# EAGLE board new_sawtag_2012 (EAGLE 6.5.0), part 1 of 2
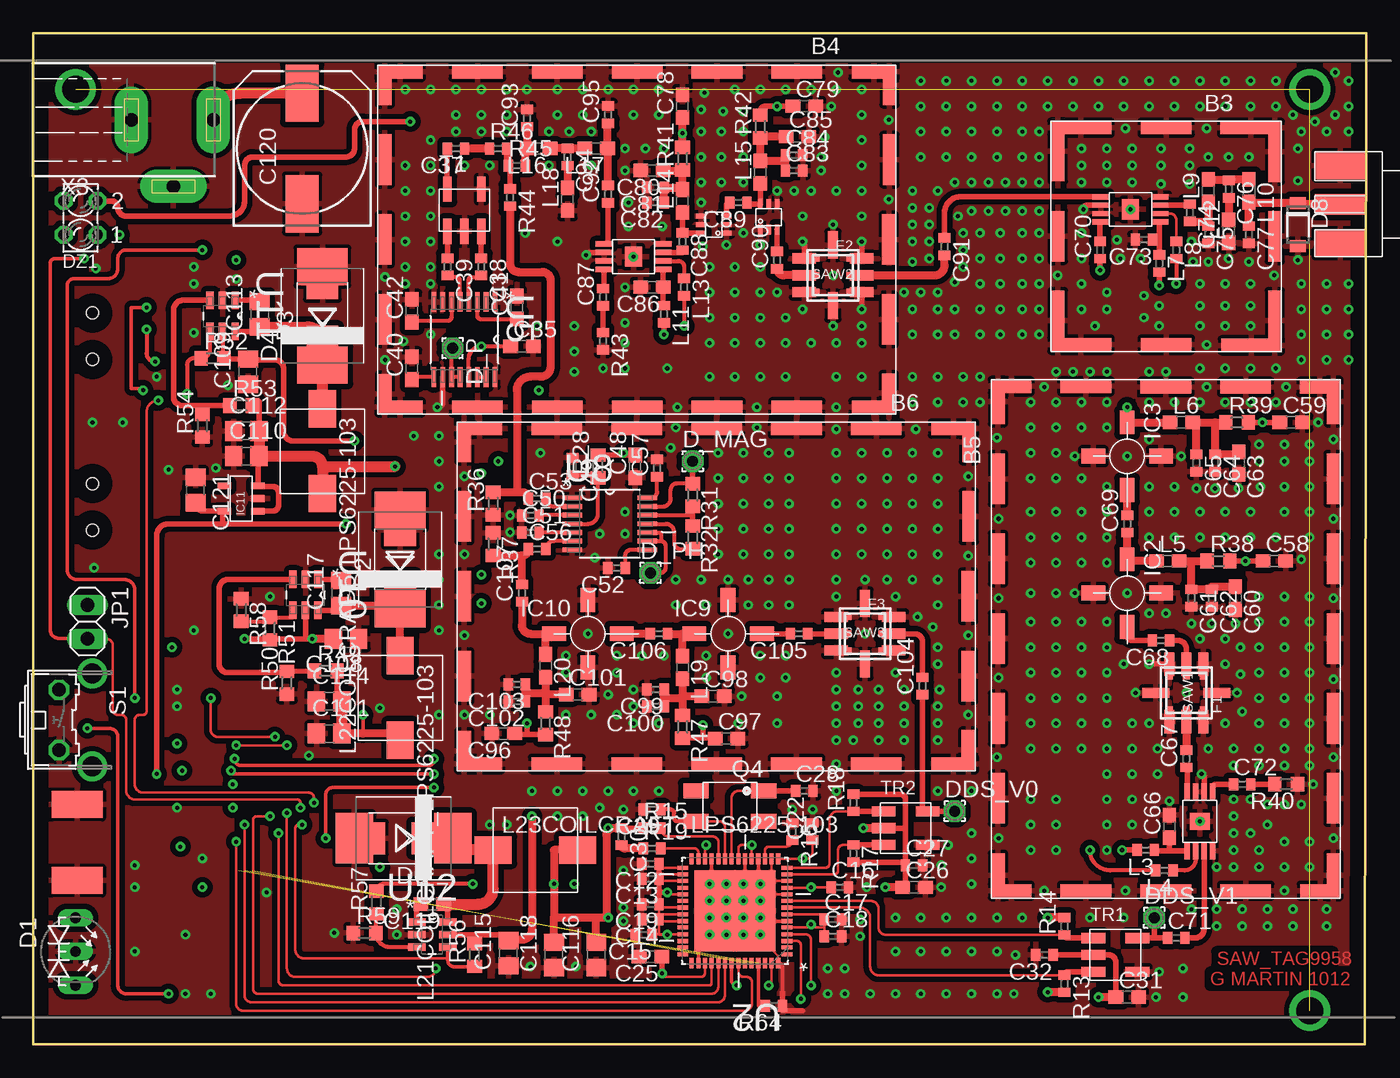
[diagram p4: board, top side]
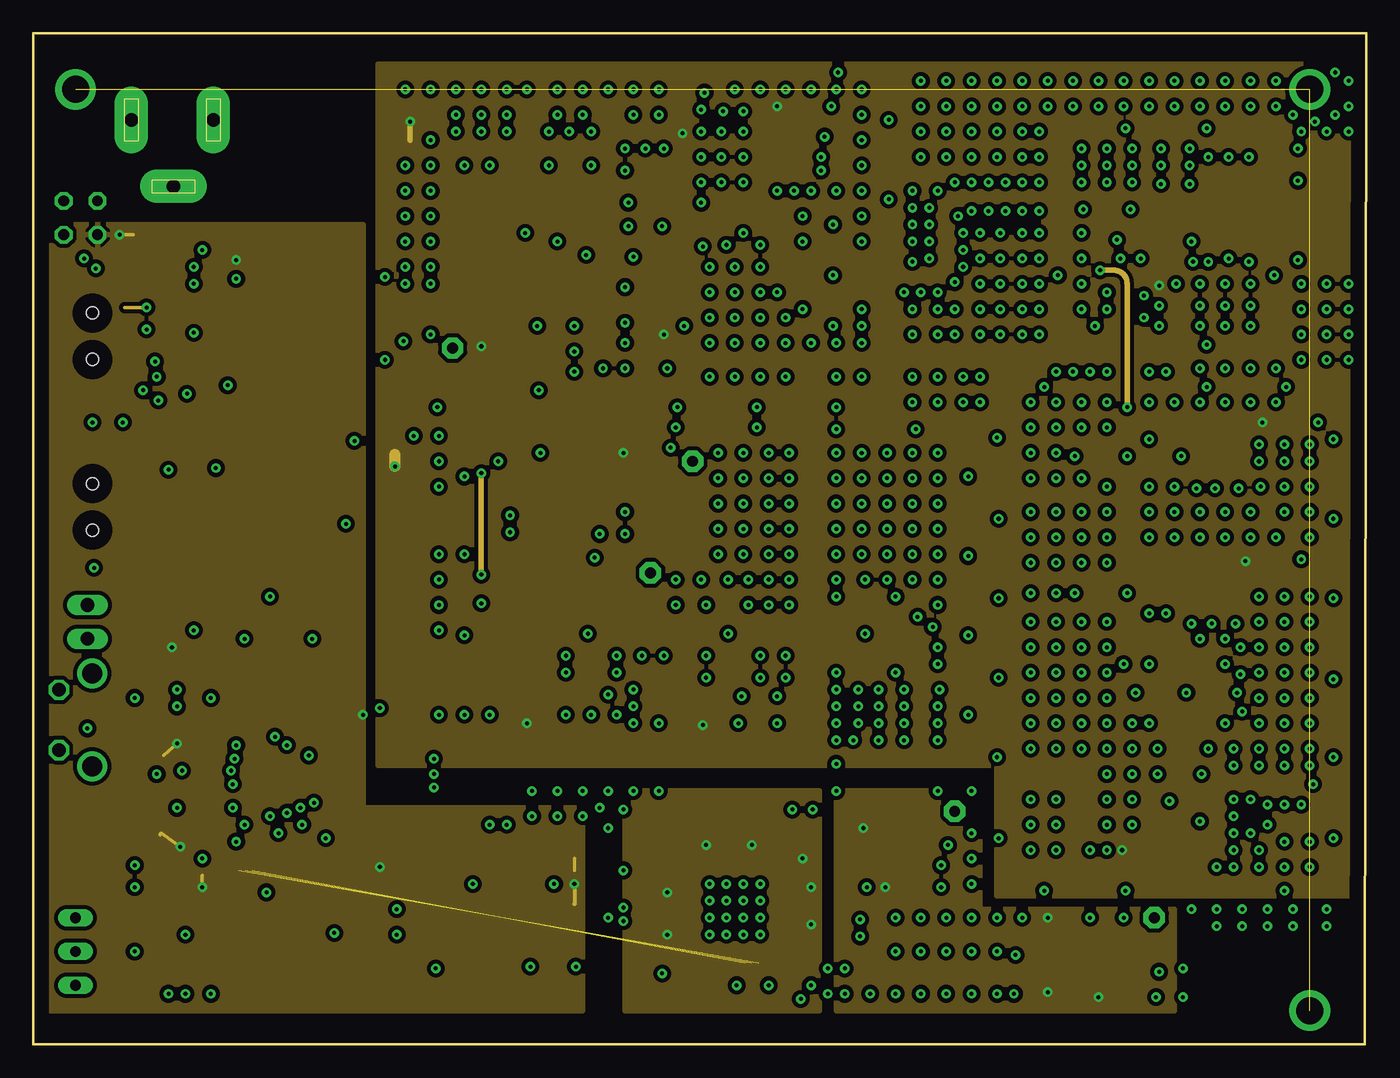
[diagram p5: board, inner layer Route2]
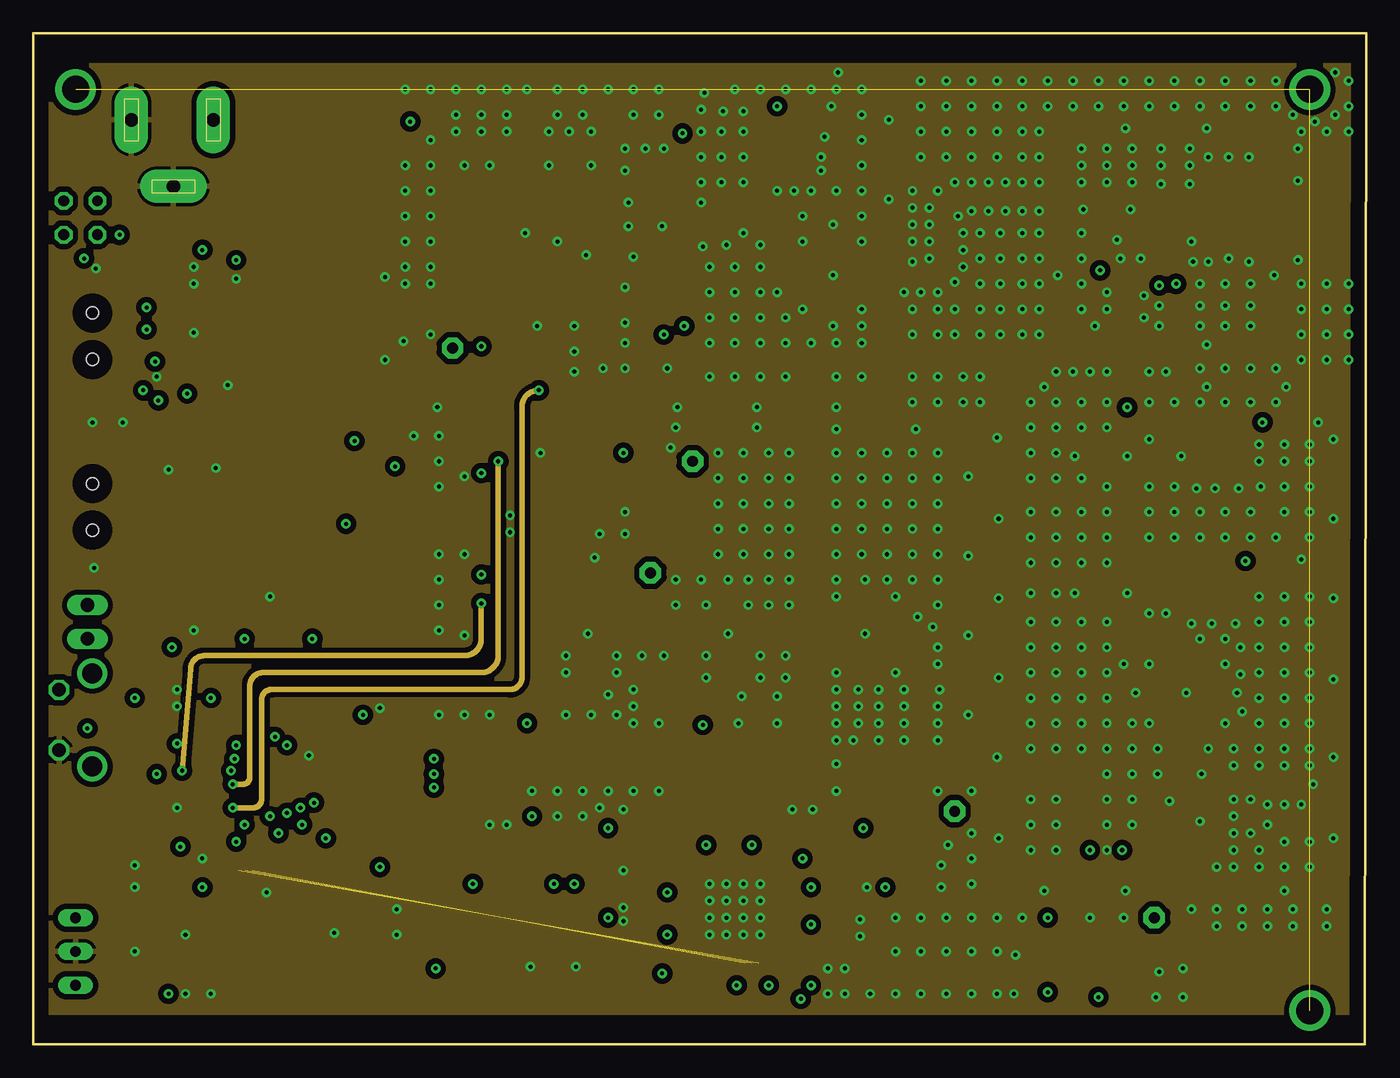
[diagram p6: board, inner layer Route3]
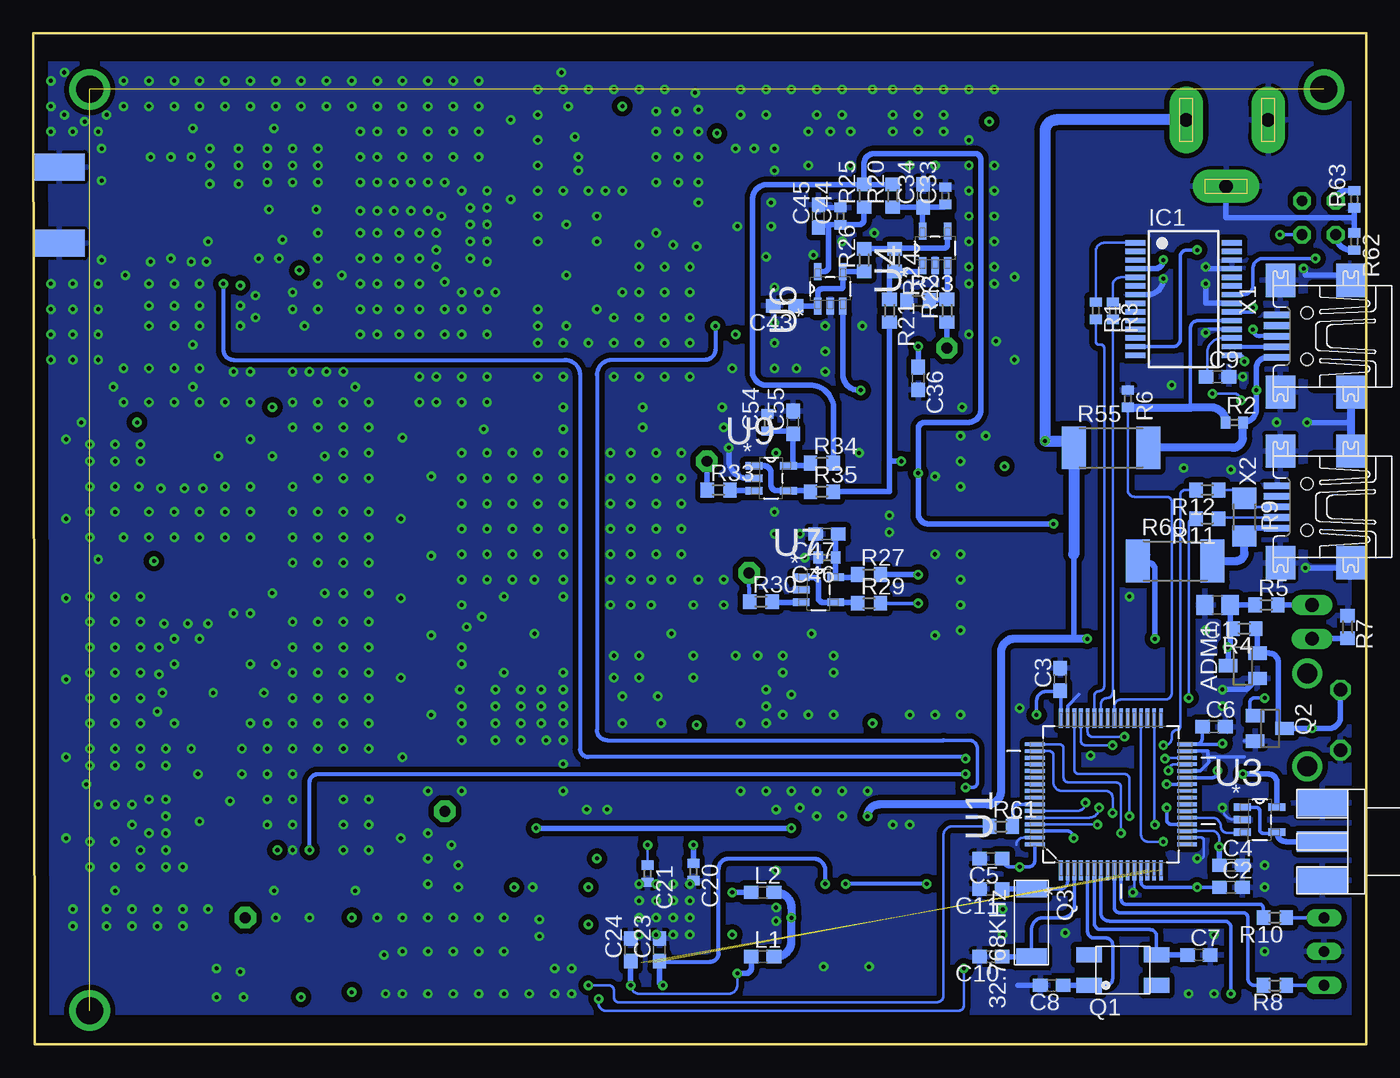
[diagram p7: board, bottom side, seen from below]

Size 100.13 x 75.97 mm. Coordinates in mm from the lower left corner, seen from the top.
Outline: 0,0 100,0 100.13,75.97 0,75.97 0,0
Copper layers (1*2+3*16): Top 0.035mm / dielectric 1.5mm / Route2 0.035mm / dielectric 0.15mm / Route3 0.035mm / dielectric 0.2mm / Bottom 0.035mm
Design rules "default": minimum track width 10mil, minimum drill 24mil, track to track 5mil, track to pad 5mil, pad to pad 5mil, via to via 5mil, smd to smd 5mil, copper to edge 40mil, drill to drill 8mil, minimum pad ring 10mil, minimum via ring 8mil, stop-mask expansion 4mil, vias tented up to drill 0mil, thermal gap 10mil

## Footprints (pad centres in the part's own frame; a part is rotated, then mirrored left to right if it is on the bottom)
SOT23 = smd 1 x 1.4: 1 -0.95,-1.1; 2 0.95,-1.1; 3 0,1.1
BMIS-102 = smd 4.55 x 1: P$1 2.25,0.5; P$3 15.05,0.45; P$10 2.25,16.8; P$11 15,16.8 | smd 3.8 x 1: P$2 8.65,0.5; P$12 8.65,16.8 | smd 1 x 4.55: P$4 0.5,2.3; P$6 0.5,15.05; P$7 16.8,2.3; P$9 16.8,15 | smd 1 x 3.8: P$5 0.5,8.65; P$8 16.8,8.65
BMIS-205 = smd 3.35 x 1: P$1 1.65,0.5; P$7 37.25,0.5; P$13 1.65,25.7; P$19 37.25,25.7 | smd 3.8 x 1: P$2 7.45,0.5; P$3 13.45,0.5; P$4 19.45,0.5; P$5 25.45,0.5; P$6 31.45,0.5; P$14 7.45,25.7; P$15 13.45,25.7; P$16 19.45,25.7; P$17 25.45,25.7; P$18 31.45,25.7 | smd 1 x 3: P$8 0.5,1.5; P$12 0.5,24.7; P$20 38.35,1.55; P$24 38.4,24.7 | smd 1 x 3.8: P$9 0.5,7.1; P$10 0.5,13.1; P$11 0.5,19.1; P$21 38.35,7.1; P$22 38.35,13.1; P$23 38.4,19.1
C0805 = smd 1.3 x 1.5: 1 -0.95,0; 2 0.95,0
C0603 = smd 1.1 x 1: 1 -0.85,0; 2 0.85,0
C0402 = smd 0.7 x 0.9: 1 -0.65,0; 2 0.65,0
140CLH-1010 = smd 4.3 x 2.5: + 4.15,0; - -4.15,0
DUOLED = drill 0.813 long: A1 -3.81,0; A2 1.27,0; K -1.27,0
SMB = smd 2.4 x 2.4: A 2.2,0; C -2.2,0
SMC = smd 2.8 x 3.8: A 3.7,0; C -3.7,0
SOD123FL = smd 0.91 x 1.22: A 1.625,0; C -1.625,0
1,6/0,8 = drill 0.813 pad 1.6 octagon: 1 0,0
LZR182 = drill 0.813 octagon: A1 -1.27,1.27; A2 -1.27,-1.27; K1 1.27,1.27; K2 1.27,-1.27
BOITIER_3-3 = smd 1.524 x 0.508: P$1 -1.778,1.27; P$2 -1.778,0; P$3 -1.778,-1.27; P$4 1.778,-1.27; P$5 1.778,0; P$6 1.778,1.27
SSOP28 = smd 0.4 x 1.5: 1 -4.225,-3.625; 2 -3.575,-3.625; 3 -2.925,-3.625; 4 -2.275,-3.625; 5 -1.625,-3.625; 6 -0.975,-3.625; 7 -0.325,-3.625; 8 0.325,-3.625; 9 0.975,-3.625; 10 1.625,-3.625; 11 2.275,-3.625; 12 2.925,-3.625; 13 3.575,-3.625; 14 4.225,-3.625; 15 4.225,3.625; 16 3.575,3.625; 17 2.925,3.625; 18 2.275,3.625; 19 1.625,3.625; 20 0.975,3.625; 21 0.325,3.625; 22 -0.325,3.625; 23 -0.975,3.625; 24 -1.625,3.625; 25 -2.275,3.625; 26 -2.925,3.625; 27 -3.575,3.625; 28 -4.225,3.625
VV105 = smd 1.778 x 1.118: 1 -2.54,0; 3 2.54,0 | smd 1.118 x 1.778: 2 0,-2.54; 4 0,2.54
SMT-MS8G = smd 0.406 x 1.27: P$1 -0.953,-2.223; P$2 -0.318,-2.223; P$3 0.318,-2.223; P$4 0.953,-2.223; P$5 0.953,2.223; P$6 0.318,2.223; P$7 -0.318,2.223; P$8 -0.953,2.223 | smd 1.524 x 1.27: P$9 0,0
SOT363 = smd 0.356 x 0.762: P$1 0,0; P$2 0.635,0; P$3 1.27,0; P$4 1.27,1.905; P$5 0.635,1.905; P$6 0,1.905
SOT23-M5 = smd 0.508 x 1.016: 1 -0.953,-1.27; 2 0,-1.27; 3 0.953,-1.27; 4 0.953,1.27; 5 -0.953,1.27
SMA_BORDMIN = smd 3.81 x 2.032: P1 3.175,-2.921; P3 3.175,2.921 | smd 3.81 x 1.524: P2 3.175,0 | smd 3.81 x 2.032 bottom: P4 3.175,2.921; P5 3.175,-2.794
1X02 = drill 1.016 long: 1 -1.27,0; 2 1.27,0
0603 = smd 1.1 x 1: 1 -0.85,0; 2 0.85,0
0402 = smd 0.7 x 0.9: 1 -0.015,0; 2 1.285,0
L_DCDC_6*6 = smd 2.794 x 2.032: P$1 0,0; P$2 6.35,0
SMD_5*3 = smd 1.905 x 1.143: P$1 -2.54,-1.143; P$2 2.54,-1.143; P$3 2.54,1.143; P$4 -2.54,1.143
SMD_32K = smd 1.27 x 2.286: P$1 -2.54,0; P$2 2.54,0
R0402 = smd 0.7 x 0.9: 1 -0.65,0; 2 0.65,0
R0603 = smd 1 x 1.1: 1 -0.85,0; 2 0.85,0
R1206 = smd 1.6 x 1.803: 1 -1.422,0; 2 1.422,0
R2512 = smd 1.8 x 3.2: 1 -2.8,0; 2 2.8,0
B3F-31XX = drill 1.016 octagon: 1 -2.261,-1.245; 2 2.261,-1.245 | drill 1.499 pad 2.159: 3 -3.505,1.245; 4 3.505,1.245
BOITIER_5-5 = smd 1.778 x 0.762: P$1 -2.159,1.27; P$2 -2.159,0; P$3 -2.159,-1.27; P$4 2.159,-1.27; P$5 2.159,0; P$6 2.159,1.27 | smd 0.762 x 2.032: P$7 0,2.286; P$8 0,-2.286
SM-22 = smd 0.635 x 1.905: 1 -1.27,-1.905; 2 0,-1.905; 3 1.27,-1.905; 4 1.27,1.27; 5 -1.27,1.27
AT224-3 = smd 1.778 x 0.762: P1 -1.651,1.27; P2 -1.651,0; P3 -1.651,-1.27; P4 1.651,-1.27; P6 1.651,1.27
QFP50P1200X1200X160-64N = smd 1.473 x 0.279: 1 -5.715,3.759; 2 -5.715,3.251; 3 -5.715,2.743; 4 -5.715,2.261; 5 -5.715,1.753; 6 -5.715,1.245; 7 -5.715,0.762; 8 -5.715,0.254; 9 -5.715,-0.254; 10 -5.715,-0.762; 11 -5.715,-1.245; 12 -5.715,-1.753; 13 -5.715,-2.261; 14 -5.715,-2.743; 15 -5.715,-3.251; 16 -5.715,-3.759; 33 5.715,-3.759; 34 5.715,-3.251; 35 5.715,-2.743; 36 5.715,-2.261; 37 5.715,-1.753; 38 5.715,-1.245; 39 5.715,-0.762; 40 5.715,-0.254; 41 5.715,0.254; 42 5.715,0.762; 43 5.715,1.245; 44 5.715,1.753; 45 5.715,2.261; 46 5.715,2.743; 47 5.715,3.251; 48 5.715,3.759 | smd 0.279 x 1.473: 17 -3.759,-5.715; 18 -3.251,-5.715; 19 -2.743,-5.715; 20 -2.261,-5.715; 21 -1.753,-5.715; 22 -1.245,-5.715; 23 -0.762,-5.715; 24 -0.254,-5.715; 25 0.254,-5.715; 26 0.762,-5.715; 27 1.245,-5.715; 28 1.753,-5.715; 29 2.261,-5.715; 30 2.743,-5.715; 31 3.251,-5.715; 32 3.759,-5.715; 49 3.759,5.715; 50 3.251,5.715; 51 2.743,5.715; 52 2.261,5.715; 53 1.753,5.715; 54 1.245,5.715; 55 0.762,5.715; 56 0.254,5.715; 57 -0.254,5.715; 58 -0.762,5.715; 59 -1.245,5.715; 60 -1.753,5.715; 61 -2.261,5.715; 62 -2.743,5.715; 63 -3.251,5.715; 64 -3.759,5.715
QFN50P800X800X100-57N = smd 0.813 x 0.305: 1 -3.912,3.251; 2 -3.912,2.743; 3 -3.912,2.261; 4 -3.912,1.753; 5 -3.912,1.245; 6 -3.912,0.762; 7 -3.912,0.254; 8 -3.912,-0.254; 9 -3.912,-0.762; 10 -3.912,-1.245; 11 -3.912,-1.753; 12 -3.912,-2.261; 13 -3.912,-2.743; 14 -3.912,-3.251; 29 3.912,-3.251; 30 3.912,-2.743; 31 3.912,-2.261; 32 3.912,-1.753; 33 3.912,-1.245; 34 3.912,-0.762; 35 3.912,-0.254; 36 3.912,0.254; 37 3.912,0.762; 38 3.912,1.245; 39 3.912,1.753; 40 3.912,2.261; 41 3.912,2.743; 42 3.912,3.251 | smd 0.305 x 0.813: 15 -3.251,-3.912; 16 -2.743,-3.912; 17 -2.261,-3.912; 18 -1.753,-3.912; 19 -1.245,-3.912; 20 -0.762,-3.912; 21 -0.254,-3.912; 22 0.254,-3.912; 23 0.762,-3.912; 24 1.245,-3.912; 25 1.753,-3.912; 26 2.261,-3.912; 27 2.743,-3.912; 28 3.251,-3.912; 43 3.251,3.912; 44 2.743,3.912; 45 2.261,3.912; 46 1.753,3.912; 47 1.245,3.912; 48 0.762,3.912; 49 0.254,3.912; 50 -0.254,3.912; 51 -0.762,3.912; 52 -1.245,3.912; 53 -1.753,3.912; 54 -2.261,3.912; 55 -2.743,3.912; 56 -3.251,3.912 | smd 6.096 x 6.096: 57 0,0
SOT95P280X145-5N = smd 1.27 x 0.559: 1 -1.295,0.94; 2 -1.295,0; 3 -1.295,-0.94; 4 1.295,-0.94; 5 1.295,0.94
SOP65P640X120-16N = smd 1.473 x 0.356: 1 -2.819,2.286; 2 -2.819,1.626; 3 -2.819,0.965; 4 -2.819,0.33; 5 -2.819,-0.33; 6 -2.819,-0.965; 7 -2.819,-1.626; 8 -2.819,-2.286; 9 2.819,-2.286; 10 2.819,-1.626; 11 2.819,-0.965; 12 2.819,-0.33; 13 2.819,0.33; 14 2.819,0.965; 15 2.819,1.626; 16 2.819,2.286
SOP65P640X120-14N = smd 1.473 x 0.356: 1 -2.819,1.956; 2 -2.819,1.295; 3 -2.819,0.66; 4 -2.819,0; 5 -2.819,-0.66; 6 -2.819,-1.295; 7 -2.819,-1.956; 8 2.819,-1.956; 9 2.819,-1.295; 10 2.819,-0.66; 11 2.819,0; 12 2.819,0.66; 13 2.819,1.295; 14 2.819,1.956
SOT95P280X90-6N = smd 1.321 x 0.559: 1 -1.168,0.94; 2 -1.168,0; 3 -1.168,-0.94; 4 1.168,-0.94; 5 1.168,0; 6 1.168,0.94
UX60-MB-5ST = smd 2 x 0.5: 1 2.25,1.6; 2 2.25,0.8; 3 2.25,0; 4 2.25,-0.8; 5 2.25,-1.6 | smd 2.2 x 2.5: M1 -3.3,-4.2; M2 -3.3,4.2; M3 2,4.2; M4 2,-4.2 | hole 0.9: 0,-1.75; 0,1.75
733980-62 = drill 1 pad 2.5 long: 1 0,8.57; 2 0,2.42; 3 5,5.57

## Placement (x,y rotation side)
ADM1  [SOT23]  9.27,28.45 90 bottom
B3  BMIS-102  [BMIS-102]  76.45,52.07 0 top
B4  BMIS-205  [BMIS-205]  25.91,47.37 0 top
B5  BMIS-205  [BMIS-205]  98.17,11.05 90 top
B6  BMIS-205  [BMIS-205]  31.88,20.57 0 top
C1  1µF  [C0805]  11.18,33.02 180 bottom
C2  100nF  [C0603]  10.16,11.81 0 bottom
C3  100nF  [C0603]  22.99,27.43 90 bottom
C4  100nF  [C0603]  10.16,13.46 0 bottom
C5  100nF  [C0603]  28.19,13.97 180 bottom
C6  100nF  [C0603]  11.43,23.88 0 bottom
C7  13pF  [C0603]  12.57,6.73 0 bottom
C8  13pF  [C0603]  23.62,4.45 180 bottom
C9  100nF  [C0603]  11.18,50.16 0 bottom
C10  13pF  [C0603]  28.19,6.6 180 bottom
C11  13pF  [C0603]  28.19,11.68 180 bottom
C12  100nF  [C0402]  46.35,13.59 180 top
C13  100nF  [C0402]  46.35,12.45 180 top
C14  100nF  [C0402]  46.35,9.4 180 top
C15  100nF  [C0402]  45.85,8.26 180 top
C16  100nF  [C0402]  60.58,11.81 0 top
C17  100nF  [C0402]  60.07,9.4 0 top
C18  100nF  [C0402]  60.07,8.13 0 top
C19  100nF  [C0402]  46.35,10.54 180 top
C20  100nF  [C0402]  50.55,12.95 270 bottom
C21  100nF  [C0402]  53.98,12.83 270 bottom
C22  100nF  [C0402]  58.55,16 90 top
C23  100nF  [C0603]  53.09,7.11 90 bottom
C24  100nF  [C0603]  55.24,7.11 90 bottom
C25  100nF  [C0603]  46.35,6.6 180 top
C26  100nF  [C0603]  66.17,11.81 0 top
C27  1nF  [C0402]  66.17,13.46 0 top
C28  39p  [C0402]  57.91,19.05 0 top
C29  39p  [C0402]  46.48,17.65 180 top
C30  680p  [C0402]  44.2,15.62 270 top
C31  100nF  [C0603]  82.17,3.56 0 top
C32  1nF  [C0402]  75.95,6.73 180 top
C33  100nF  [C0402]  31.62,63.75 90 bottom
C34  1µF  [C0603]  33.27,63.75 90 bottom
C35  100nF  [C0603]  36.7,52.45 0 top
C36  100pF  [C0603]  33.66,50.04 270 bottom
C37  100p  [C0402]  31.75,67.31 180 top
C38  100pF  [C0402]  33.66,58.42 270 top
C39  100pF  [C0402]  31.11,58.42 270 top
C40  330pF  [C0603]  28.45,50.8 90 top
C41  1nF  [C0603]  36.32,55.37 90 top
C42  1nF  [C0603]  28.45,55.12 90 top
C43  1µF  [C0603]  43.69,55.5 180 bottom
C44  100nF  [C0402]  39.5,62.23 90 bottom
C45  1µF  [C0603]  41.15,62.23 90 bottom
C46  100nF  [C0402]  40.51,36.58 180 bottom
C47  1µF  [C0603]  40.51,38.35 180 bottom
C48  100nF  [C0603]  45.21,43.43 90 top
C49  100pF  [C0402]  40.51,43.43 270 top
C50  1nF  [C0402]  37.34,39.75 0 top
C51  1nF  [C0402]  37.34,38.48 0 top
C52  1nF  [C0402]  43.81,35.81 180 top
C53  1nF  [C0402]  37.85,41.02 0 top
C54  100nF  [C0402]  44.96,46.74 90 bottom
C55  1µF  [C0603]  43.05,46.74 90 bottom
C56  1nF  [C0402]  37.85,37.21 0 top
C57  1nF  [C0402]  46.86,43.31 90 top
C58  100nF  [C0603]  93.22,36.32 0 top
C59  100nF  [C0603]  94.49,46.74 0 top
C60  1µF  [C0603]  90.3,33.53 270 top
C61  1nF  [C0402]  87,33.53 270 top
C62  100pF  [C0402]  88.52,33.53 270 top
C63  1µF  [C0603]  90.55,43.69 270 top
C64  1nF  [C0402]  88.77,43.69 270 top
C65  100pF  [C0402]  87.38,43.69 270 top
C66  100nF  [C0603]  85.34,16.38 90 top
C67  22pF  [C0402]  86.61,21.46 90 top
C68  22pF  [C0402]  84.71,30.35 180 top
C69  22pF  [C0402]  82.17,39.12 90 top
C70  22pF  [C0402]  80.14,59.69 90 top
C71  22pF  [C0402]  85.85,8 0 top
C72  22pF  [C0402]  90.81,19.56 0 top
C73  100nF  [C0402]  83.44,60.45 180 top
C74  220pF  [C0402]  86.87,62.48 270 top
C75  10pF  [C0402]  88.27,60.83 270 top
C76  15pF  [C0402]  89.79,64.26 270 top
C77  10pF  [C0402]  91.31,60.83 270 top
C78  100nF  [C0603]  48.77,70.48 90 top
C79  100nF  [C0603]  57.91,70.48 0 top
C80  1µF  [C0603]  46.48,65.66 180 top
C81  1nF  [C0402]  46.74,64.39 180 top
C82  100pF  [C0402]  46.74,63.25 180 top
C83  100pF  [C0402]  57.15,65.66 0 top
C84  1nF  [C0402]  57.15,66.8 0 top
C85  1µF  [C0603]  57.4,68.2 0 top
C86  100nF  [C0603]  46.48,56.9 180 top
C87  22pF  [C0402]  42.8,56.13 90 top
C88  22pF  [C0402]  48.77,60.33 270 top
C89  22pF  [C0402]  52.96,63.25 180 top
C90  22pF  [C0402]  55.88,58.93 90 top
C91  22pF  [C0402]  68.45,59.94 270 top
C92  220pF  [C0402]  43.18,63.88 90 top
C93  10pF  [C0402]  37.08,69.6 90 top
C94  15pF  [C0402]  40.13,66.67 270 top
C95  10pF  [C0402]  43.18,69.85 90 top
C96  100nF  [C0603]  35.31,23.37 180 top
C97  100nF  [C0603]  52.07,22.99 0 top
C98  1µF  [C0603]  51.05,26.16 0 top
C99  1nF  [C0402]  46.74,26.67 180 top
C100  100pF  [C0402]  46.74,25.4 180 top
C101  1µF  [C0603]  40.89,26.29 0 top
C102  1nF  [C0402]  36.32,25.78 180 top
C103  100pF  [C0402]  36.32,27.05 180 top
C104  22pF  [C0402]  66.8,26.92 90 top
C105  22pF  [C0402]  57.53,30.86 180 top
C106  22pF  [C0402]  46.99,30.86 180 top
C107  22pF  [C0402]  36.7,33.91 90 top
C108  10µF  [C0805]  23.5,30.48 180 top
C109  10µF  [C0805]  16.13,50.55 90 top
C110  22µF  [C0805]  16,44.2 0 top
C111  22µF  [C0805]  22.23,23.37 0 top
C112  100nF  [C0805]  16,46.1 0 top
C113  100nF  [C0805]  17.02,54.86 90 top
C114  100nF  [C0805]  22.23,25.78 0 top
C115  10µF  [C0805]  35.69,6.86 90 top
C116  22µF  [C0805]  42.29,6.73 90 top
C117  100nF  [C0805]  23.11,33.91 90 top
C118  100nF  [C0805]  39.12,6.73 90 top
C119  100nF  [C0603]  29.97,10.54 180 top
C120  100µF  [140CLH-1010]  20.19,67.31 90 top
C121  100nF  [C0805]  12.19,41.66 270 top
D1  [DUOLED]  3.17,5.71 270 top
D2  [SMB]  27.56,36.45 90 top
D3  [SMB]  21.72,54.99 90 top
D4  [SMC]  21.72,54.74 90 top
D5  [SMC]  27.56,36.45 90 top
D6  [SMB]  27.43,15.49 180 top
D7  [SMC]  27.81,15.49 180 top
D8  [SOD123FL]  95,61.59 270 top
D_MAG  [1,6/0,8]  49.53,43.81 0 top
D_P  [1,6/0,8]  31.5,52.32 270 top
D_PH  [1,6/0,8]  46.35,35.43 0 top
DDS_V0  [1,6/0,8]  69.22,17.53 0 top
DDS_V1  [1,6/0,8]  84.2,9.53 0 top
DZ1  LZR182  [LZR182]  3.56,62.1 180 top
F1  SAW_FILTER_33F  [BOITIER_3-3]  86.61,26.42 90 top
F2  SAW_FILTER_33F  [BOITIER_3-3]  60.07,57.78 180 top
F3  SAW_FILTER_33F  [BOITIER_3-3]  62.48,30.86 180 top
IC1  FT232RL  [SSOP28]  13.72,56.01 270 bottom
IC2  HMC474MP86  [VV105]  82.17,33.91 90 top
IC3  HMC474MP86  [VV105]  82.17,44.2 90 top
IC4  HMC349MS8G  [SMT-MS8G]  87.63,16.76 0 top
IC5  HMC349MS8G  [SMT-MS8G]  82.42,62.74 90 top
IC6  HMC349MS8G  [SMT-MS8G]  45.09,59.18 90 top
IC7  SGA-3563Z  [SOT363]  52.07,60.96 90 top
IC8  SGA-3563Z  [SOT363]  54.61,61.21 0 top
IC9  HMC474MP86  [VV105]  52.2,30.86 180 top
IC10  HMC474MP86  [VV105]  41.66,30.86 180 top
IC11  LP2981AIM5-3.3  [SOT23-M5]  15.62,41.02 90 top
J1  SMA-BORDMIN  [SMA_BORDMIN]  0.13,15.24 180 bottom
J2  SMA-BORDMIN  [SMA_BORDMIN]  101.35,63.12 180 top
JP1  [1X02]  4.06,31.75 270 top
L1  0  [0603]  45.34,6.6 0 bottom
L2  0  [0603]  45.34,11.43 0 bottom
L3  [0402]  84.2,14.61 180 top
L4  [0402]  85.6,13.08 180 top
L5  100nH  [0603]  85.22,36.32 0 top
L6  100nH  [0603]  86.23,46.74 0 top
L7  BLM15BB221SN1  [0402]  84.58,59.31 270 top
L8  BLM15BB221SN1  [0402]  85.85,60.33 270 top
L9  15nH  [0603]  88.27,64.14 90 top
L10  15nH  [0603]  91.31,64.14 270 top
L11  BLM15BB221SN1  [0402]  47.37,55.5 270 top
L12  1,8nH  [0603]  89.79,61.09 90 top
L13  BLM15BB221SN1  [0402]  48.9,57.53 270 top
L14  68nH  [0603]  48.77,63.37 90 top
L15  68nH  [0603]  54.61,65.53 90 top
L16  15nH  [0603]  37.97,67.31 180 top
L17  15nH  [0603]  42.29,67.31 180 top
L18  1,8nH  [0603]  40.13,63.5 90 top
L19  100nH  [0603]  48.77,28.32 270 top
L20  100nH  [0603]  38.48,28.45 270 top
L21COILCRAFT_LPS6225-103  10uH  [L_DCDC_6*6]  27.56,29.21 270 top
L22COILCRAFT_LPS6225-103  10uH  [L_DCDC_6*6]  21.72,47.75 270 top
L23COILCRAFT_LPS6225-103  10uH  [L_DCDC_6*6]  34.54,14.61 0 top
Q1  8MHZ  [SMD_5*3]  18.29,5.59 0 bottom
Q2  2n2222  [SOT23]  7.24,23.75 270 bottom
Q3  32.768KHz  [SMD_32K]  25.15,9.14 270 bottom
Q4  20MHz  [SMD_5*3]  52.32,17.91 180 top
R1  30k  [R0402]  20.32,55.12 270 bottom
R2  4k7  [R0402]  9.91,46.74 0 bottom
R3  30k  [R0402]  19.05,55.12 270 bottom
R4  5600  [R0603]  9.14,31.24 180 bottom
R5  5600  [R0603]  7.49,33.02 0 bottom
R6  10k  [R0402]  17.91,48.51 270 bottom
R7  5600  [R0603]  1.4,31.37 270 bottom
R8  1k  [R0603]  6.86,4.45 180 bottom
R9  1500  [R1206]  9.14,39.62 270 bottom
R10  1k  [R0603]  6.86,9.53 180 bottom
R11  22  [R0603]  11.94,39.5 180 bottom
R12  22  [R0603]  11.94,41.66 180 bottom
R13  50  [R0402]  77.47,4.57 270 top
R14  50  [R0402]  77.47,8.89 90 top
R15  2K  [R0402]  46.48,16.26 0 top
R16  1,91K  [R0402]  57.02,16 270 top
R17  50  [R0402]  61.59,14.35 270 top
R18  50  [R0402]  61.59,18.16 90 top
R19  698  [R0402]  46.48,14.73 0 top
R20  12  [R0603]  35.56,63.75 90 bottom
R21  0  [R0603]  35.81,55.12 270 bottom
R22  0  [R0603]  31.5,55.12 90 bottom
R23  4k7  [R0603]  33.66,55.88 0 bottom
R24  4k7  [R0603]  35.43,58.93 270 bottom
R25  12  [R0603]  37.72,63.75 90 bottom
R26  2k  [R0603]  37.72,58.93 90 bottom
R27  12  [R0603]  37.34,35.31 0 bottom
R28  0  [R0603]  42.42,43.43 90 top
R29  0  [R0603]  37.34,33.15 0 bottom
R30  0  [R0603]  45.47,33.27 0 bottom
R31  0  [R0603]  49.53,41.27 270 top
R32  NC  [R0603]  49.53,38.1 270 top
R33  0  [R0603]  48.64,41.66 0 bottom
R34  12  [R0603]  40.89,43.69 0 bottom
R35  0  [R0603]  40.89,41.53 0 bottom
R36  52.3  [R0603]  34.54,40.64 90 top
R37  52.3  [R0603]  34.54,37.59 270 top
R38  18  [R0603]  89.03,36.32 0 top
R39  18  [R0603]  90.42,46.74 0 top
R40  50  [R0603]  94.11,19.56 180 top
R41  51  [R0603]  48.77,66.55 90 top
R42  51  [R0603]  54.61,68.96 90 top
R43  50  [R0402]  42.8,52.83 270 top
R44  50  [R0402]  35.81,63.63 270 top
R45  50  [R0402]  36.32,66.04 0 top
R46  50  [R0402]  34.92,67.31 0 top
R47  18  [R0603]  48.77,23.88 270 top
R48  18  [R0603]  38.48,24.13 270 top
R49  31.6k  [R0603]  21.97,28.07 0 top
R50  10.2k  [R0603]  19.05,27.18 90 top
R51  3200  [R0603]  17.78,31.24 270 top
R52  100k  [R0603]  13.46,51.56 0 top
R53  52.3k  [R0603]  15.62,48.01 0 top
R54  10k  [R0603]  12.7,46.48 90 top
R55  [R2512]  19.18,44.83 0 bottom
R56  100k  [R0603]  33.15,6.73 90 top
R57  12.7k  [R0603]  25.78,10.67 90 top
R58  10k  [R0603]  15.62,32.64 270 top
R59  10.2k  [R0603]  24.89,8.38 0 top
R60  [R2512]  14.35,36.32 0 bottom
R61  0  [R0603]  27.43,16.38 0 bottom
R62  500  [R0402]  0.89,60.33 270 bottom
R63  500  [R0402]  0.89,63.5 90 bottom
R64  1200  [R0402]  55.63,2.92 180 top
S1  [B3F-31XX]  3.17,24.38 270 top
SAW1  SAW_DBLPORT  [BOITIER_5-5]  86.61,26.42 90 top
SAW2  SAW_DBLPORT  [BOITIER_5-5]  60.07,57.78 180 top
SAW3  SAW_DBLPORT  [BOITIER_5-5]  62.48,30.86 180 top
T1  ETK4-2T  [SM-22]  32.38,62.99 0 top
TR1  TC4-1WG2+  [AT224-3]  81.28,6.73 0 top
TR2  TC4-1WG2+  [AT224-3]  65.53,16.26 0 top
U1  STM32F103RCT6  [QFP50P1200X1200X160-64N]  19.18,18.8 90 bottom
U2  AD9958BCPZ  [QFN50P800X800X100-57N]  52.7,10.03 180 top
U3  TLV2371IDBVT  [SOT95P280X145-5N]  8,16.89 0 bottom
U4  TLV2371IDBVT  [SOT95P280X145-5N]  32.38,59.82 90 bottom
U5  AD8362ARUZ  [SOP65P640X120-16N]  32.38,52.96 270 top
U6  TLV2371IDBVT  [SOT95P280X145-5N]  40.26,56.77 90 bottom
U7  TLV2371IDBVT  [SOT95P280X145-5N]  41.15,34.16 0 bottom
U8  AD8302ARUZ  [SOP65P640X120-14N]  43.31,39.12 0 top
U9  TLV2371IDBVT  [SOT95P280X145-5N]  44.7,42.55 0 bottom
U10  ADP2301AUJZ  [SOT95P280X90-6N]  20.45,33.78 270 top
U11  ADP2301AUJZ  [SOT95P280X90-6N]  14.22,54.74 270 top
U12  ADP2301AUJZ  [SOT95P280X90-6N]  29.97,8.26 0 top
X1  MINI-USB  [UX60-MB-5ST]  4.45,53.21 180 bottom
X2  MINI-USB  [UX60-MB-5ST]  4.45,40.39 180 bottom
X3  [733980-62]  4.95,69.47 270 top